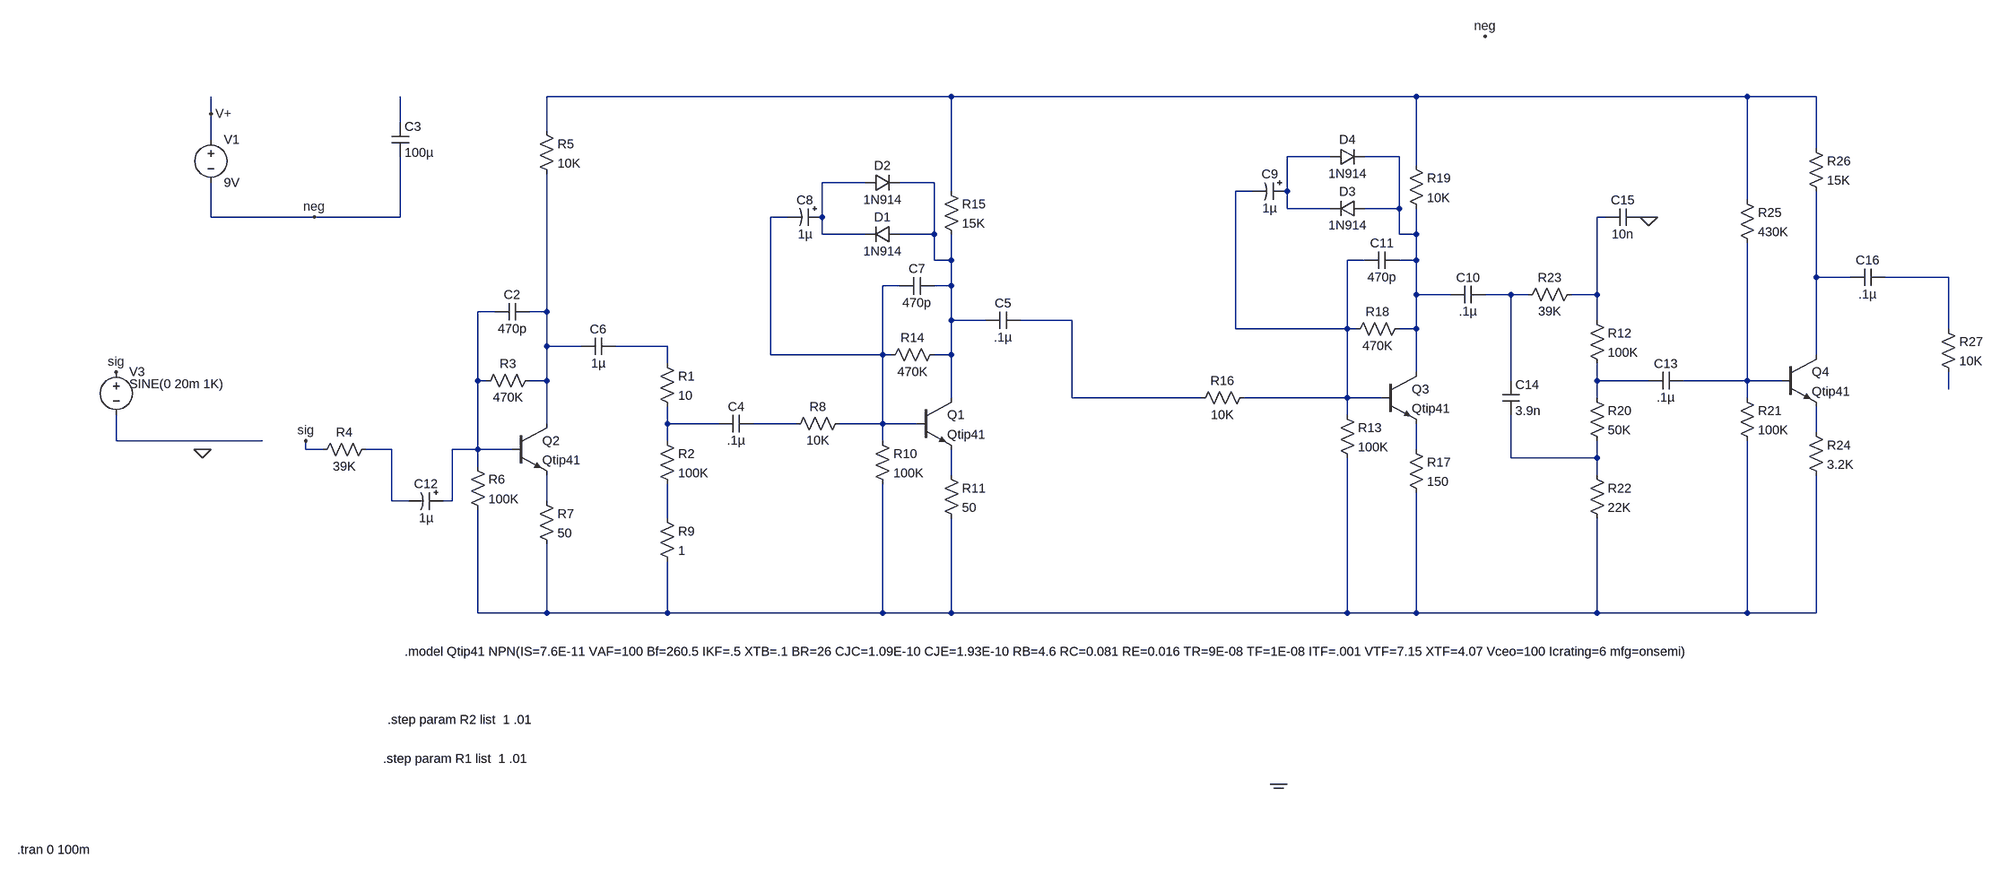
[diagram p0: schematic Bigmuff.asc]
Bigmuff.asc, the LTspice schematic file:
Version 4
SHEET 1 4968 1980
WIRE 2000 160 1248 160
WIRE 2864 160 2000 160
WIRE 3504 160 2864 160
WIRE 3632 160 3504 160
WIRE 624 192 624 160
WIRE 976 208 976 160
WIRE 1248 224 1248 160
WIRE 624 240 624 192
WIRE 3632 256 3632 160
WIRE 2704 272 2624 272
WIRE 2832 272 2768 272
WIRE 2864 288 2864 160
WIRE 1840 320 1760 320
WIRE 1968 320 1904 320
WIRE 2000 336 2000 160
WIRE 2560 336 2528 336
WIRE 2624 336 2624 272
WIRE 3504 352 3504 160
WIRE 2624 368 2624 336
WIRE 2704 368 2624 368
WIRE 2832 368 2832 272
WIRE 2832 368 2768 368
WIRE 624 384 624 320
WIRE 816 384 624 384
WIRE 976 384 976 272
WIRE 976 384 816 384
WIRE 1696 384 1664 384
WIRE 1760 384 1760 320
WIRE 3216 384 3200 384
WIRE 3296 384 3280 384
WIRE 3312 384 3296 384
WIRE 1760 416 1760 384
WIRE 1840 416 1760 416
WIRE 1968 416 1968 320
WIRE 1968 416 1904 416
WIRE 2832 416 2832 368
WIRE 2864 416 2864 368
WIRE 2864 416 2832 416
WIRE 1968 464 1968 416
WIRE 2000 464 2000 416
WIRE 2000 464 1968 464
WIRE 2768 464 2736 464
WIRE 2864 464 2864 416
WIRE 2864 464 2832 464
WIRE 3632 496 3632 336
WIRE 3696 496 3632 496
WIRE 3888 496 3760 496
WIRE 1904 512 1872 512
WIRE 2000 512 2000 464
WIRE 2000 512 1968 512
WIRE 2864 528 2864 464
WIRE 2928 528 2864 528
WIRE 3040 528 2992 528
WIRE 3072 528 3040 528
WIRE 3200 528 3200 384
WIRE 3200 528 3152 528
WIRE 1152 560 1120 560
WIRE 1248 560 1248 304
WIRE 1248 560 1216 560
WIRE 2000 576 2000 512
WIRE 2064 576 2000 576
WIRE 2224 576 2128 576
WIRE 3200 576 3200 528
WIRE 2528 592 2528 336
WIRE 2736 592 2736 464
WIRE 2736 592 2528 592
WIRE 2752 592 2736 592
WIRE 2864 592 2864 528
WIRE 2864 592 2832 592
WIRE 3888 592 3888 496
WIRE 1248 624 1248 560
WIRE 1312 624 1248 624
WIRE 1472 624 1376 624
WIRE 1664 640 1664 384
WIRE 1872 640 1872 512
WIRE 1872 640 1664 640
WIRE 1888 640 1872 640
WIRE 2000 640 2000 576
WIRE 2000 640 1968 640
WIRE 3632 640 3632 496
WIRE 1472 656 1472 624
WIRE 2864 672 2864 592
WIRE 1120 688 1120 560
WIRE 1136 688 1120 688
WIRE 1248 688 1248 624
WIRE 1248 688 1216 688
WIRE 3040 688 3040 528
WIRE 3200 688 3200 656
WIRE 3296 688 3200 688
WIRE 3504 688 3504 432
WIRE 3504 688 3360 688
WIRE 3568 688 3504 688
WIRE 3888 704 3888 672
WIRE 2000 720 2000 640
WIRE 2224 720 2224 576
WIRE 2464 720 2224 720
WIRE 2736 720 2736 592
WIRE 2736 720 2544 720
WIRE 2800 720 2736 720
WIRE 3200 720 3200 688
WIRE 3504 720 3504 688
WIRE 2736 752 2736 720
WIRE 1248 768 1248 688
WIRE 1472 768 1472 736
WIRE 1568 768 1472 768
WIRE 1712 768 1632 768
WIRE 1872 768 1872 640
WIRE 1872 768 1792 768
WIRE 1936 768 1872 768
WIRE 3632 784 3632 736
WIRE 448 800 448 752
WIRE 720 800 448 800
WIRE 1472 800 1472 768
WIRE 1872 800 1872 768
WIRE 800 816 800 800
WIRE 832 816 800 816
WIRE 960 816 912 816
WIRE 1120 816 1120 688
WIRE 1120 816 1072 816
WIRE 1184 816 1120 816
WIRE 2864 816 2864 768
WIRE 3040 832 3040 752
WIRE 3200 832 3200 800
WIRE 3200 832 3040 832
WIRE 1120 848 1120 816
WIRE 2000 864 2000 816
WIRE 3200 864 3200 832
WIRE 960 912 960 816
WIRE 992 912 960 912
WIRE 1072 912 1072 816
WIRE 1072 912 1056 912
WIRE 1248 912 1248 864
WIRE 1472 944 1472 880
WIRE 1120 1120 1120 928
WIRE 1248 1120 1248 992
WIRE 1248 1120 1120 1120
WIRE 1472 1120 1472 1024
WIRE 1472 1120 1248 1120
WIRE 1872 1120 1872 880
WIRE 1872 1120 1472 1120
WIRE 2000 1120 2000 944
WIRE 2000 1120 1872 1120
WIRE 2736 1120 2736 832
WIRE 2736 1120 2000 1120
WIRE 2864 1120 2864 896
WIRE 2864 1120 2736 1120
WIRE 3200 1120 3200 944
WIRE 3200 1120 2864 1120
WIRE 3504 1120 3504 800
WIRE 3504 1120 3200 1120
WIRE 3632 1120 3632 864
WIRE 3632 1120 3504 1120
FLAG 624 192 V+
FLAG 448 672 sig
FLAG 800 800 sig
FLAG 3296 384 0
FLAG 2608 1472 COM
FLAG 816 384 neg
FLAG 2992 -144 neg
FLAG 608 816 0
SYMBOL cap 1376 608 R90
WINDOW 0 0 32 VBottom 2
WINDOW 3 32 32 VTop 2
SYMATTR InstName C6
SYMATTR Value 1µ
SYMBOL npn 1184 768 R0
SYMATTR InstName Q2
SYMATTR Value Qtip41
SYMBOL res 1104 832 R0
SYMATTR InstName R6
SYMATTR Value 100K
SYMBOL res 1232 896 R0
SYMATTR InstName R7
SYMATTR Value 50
SYMBOL voltage 624 224 R0
SYMATTR InstName V1
SYMATTR Value 9V
SYMBOL voltage 448 656 R0
WINDOW 3 24 38 Left 2
SYMATTR Value SINE(0 20m 1K)
SYMATTR InstName V3
SYMATTR Value2 AC 1
SYMBOL res 1456 640 R0
SYMATTR InstName R1
SYMATTR Value 10
SYMBOL res 1456 784 R0
SYMATTR InstName R2
SYMATTR Value 100K
SYMBOL res 1232 672 R90
WINDOW 0 0 56 VBottom 2
WINDOW 3 32 56 VTop 2
SYMATTR InstName R3
SYMATTR Value 470K
SYMBOL res 928 800 R90
WINDOW 0 0 56 VBottom 2
WINDOW 3 32 56 VTop 2
SYMATTR InstName R4
SYMATTR Value 39K
SYMBOL cap 1216 544 R90
WINDOW 0 0 32 VBottom 2
WINDOW 3 32 32 VTop 2
SYMATTR InstName C2
SYMATTR Value 470p
SYMBOL res 1232 208 R0
SYMATTR InstName R5
SYMATTR Value 10K
SYMBOL cap 960 208 R0
SYMATTR InstName C3
SYMATTR Value 100µ
SYMBOL res 1696 784 R270
WINDOW 0 32 56 VTop 2
WINDOW 3 0 56 VBottom 2
SYMATTR InstName R8
SYMATTR Value 10K
SYMBOL cap 1568 784 R270
WINDOW 0 32 32 VTop 2
WINDOW 3 0 32 VBottom 2
SYMATTR InstName C4
SYMATTR Value .1µ
SYMBOL res 1456 928 R0
SYMATTR InstName R9
SYMATTR Value 1
SYMBOL cap 2128 560 R90
WINDOW 0 0 32 VBottom 2
WINDOW 3 32 32 VTop 2
SYMATTR InstName C5
SYMATTR Value .1µ
SYMBOL npn 1936 720 R0
SYMATTR InstName Q1
SYMATTR Value Qtip41
SYMBOL res 1856 784 R0
SYMATTR InstName R10
SYMATTR Value 100K
SYMBOL res 1984 848 R0
SYMATTR InstName R11
SYMATTR Value 50
SYMBOL res 1984 624 R90
WINDOW 0 0 56 VBottom 2
WINDOW 3 32 56 VTop 2
SYMATTR InstName R14
SYMATTR Value 470K
SYMBOL cap 1968 496 R90
WINDOW 0 0 32 VBottom 2
WINDOW 3 32 32 VTop 2
SYMATTR InstName C7
SYMATTR Value 470p
SYMBOL res 1984 320 R0
SYMATTR InstName R15
SYMATTR Value 15K
SYMBOL res 2448 736 R270
WINDOW 0 32 56 VTop 2
WINDOW 3 0 56 VBottom 2
SYMATTR InstName R16
SYMATTR Value 10K
SYMBOL diode 1904 400 R90
WINDOW 0 0 32 VBottom 2
WINDOW 3 32 32 VTop 2
SYMATTR InstName D1
SYMATTR Value 1N914
SYMBOL diode 1840 336 R270
WINDOW 0 32 32 VTop 2
WINDOW 3 0 32 VBottom 2
SYMATTR InstName D2
SYMATTR Value 1N914
SYMBOL cap 2992 512 R90
WINDOW 0 0 32 VBottom 2
WINDOW 3 32 32 VTop 2
SYMATTR InstName C10
SYMATTR Value .1µ
SYMBOL npn 2800 672 R0
SYMATTR InstName Q3
SYMATTR Value Qtip41
SYMBOL res 2720 736 R0
SYMATTR InstName R13
SYMATTR Value 100K
SYMBOL res 2848 800 R0
SYMATTR InstName R17
SYMATTR Value 150
SYMBOL res 2848 576 R90
WINDOW 0 0 56 VBottom 2
WINDOW 3 32 56 VTop 2
SYMATTR InstName R18
SYMATTR Value 470K
SYMBOL cap 2832 448 R90
WINDOW 0 0 32 VBottom 2
WINDOW 3 32 32 VTop 2
SYMATTR InstName C11
SYMATTR Value 470p
SYMBOL res 2848 272 R0
SYMATTR InstName R19
SYMATTR Value 10K
SYMBOL diode 2768 352 R90
WINDOW 0 0 32 VBottom 2
WINDOW 3 32 32 VTop 2
SYMATTR InstName D3
SYMATTR Value 1N914
SYMBOL diode 2704 288 R270
WINDOW 0 32 32 VTop 2
WINDOW 3 0 32 VBottom 2
SYMATTR InstName D4
SYMATTR Value 1N914
SYMBOL res 3184 560 R0
SYMATTR InstName R12
SYMATTR Value 100K
SYMBOL res 3184 704 R0
SYMATTR InstName R20
SYMATTR Value 50K
SYMBOL cap 3296 704 R270
WINDOW 0 32 32 VTop 2
WINDOW 3 0 32 VBottom 2
SYMATTR InstName C13
SYMATTR Value .1µ
SYMBOL res 3184 848 R0
SYMATTR InstName R22
SYMATTR Value 22K
SYMBOL res 3168 512 R90
WINDOW 0 0 56 VBottom 2
WINDOW 3 32 56 VTop 2
SYMATTR InstName R23
SYMATTR Value 39K
SYMBOL cap 3024 688 R0
SYMATTR InstName C14
SYMATTR Value 3.9n
SYMBOL cap 3280 368 R90
WINDOW 0 0 32 VBottom 2
WINDOW 3 32 32 VTop 2
SYMATTR InstName C15
SYMATTR Value 10n
SYMBOL cap 3760 480 R90
WINDOW 0 0 32 VBottom 2
WINDOW 3 32 32 VTop 2
SYMATTR InstName C16
SYMATTR Value .1µ
SYMBOL npn 3568 640 R0
SYMATTR InstName Q4
SYMATTR Value Qtip41
SYMBOL res 3488 704 R0
SYMATTR InstName R21
SYMATTR Value 100K
SYMBOL res 3616 768 R0
SYMATTR InstName R24
SYMATTR Value 3.2K
SYMBOL res 3616 240 R0
SYMATTR InstName R26
SYMATTR Value 15K
SYMBOL res 3488 336 R0
SYMATTR InstName R25
SYMATTR Value 430K
SYMBOL res 3872 576 R0
SYMATTR InstName R27
SYMATTR Value 10K
SYMBOL polcap 1760 368 R90
WINDOW 0 0 32 VBottom 2
WINDOW 3 32 32 VTop 2
SYMATTR InstName C8
SYMATTR Value 1µ
SYMBOL polcap 2624 320 R90
WINDOW 0 0 32 VBottom 2
WINDOW 3 32 32 VTop 2
SYMATTR InstName C9
SYMATTR Value 1µ
SYMBOL polcap 1056 896 R90
WINDOW 0 0 32 VBottom 2
WINDOW 3 32 32 VTop 2
SYMATTR InstName C12
SYMATTR Value 1µ
TEXT 264 1640 Left 2 !.tran 0 100m
TEXT 944 1424 Left 2 !.step param R1 list  1 .01
TEXT 984 1192 Left 2 !.model Qtip41 NPN(IS=7.6E-11 VAF=100 Bf=260.5 IKF=.5 XTB=.1 BR=26 CJC=1.09E-10 CJE=1.93E-10 RB=4.6 RC=0.081 RE=0.016 TR=9E-08 TF=1E-08 ITF=.001 VTF=7.15 XTF=4.07 Vceo=100 Icrating=6 mfg=onsemi)
TEXT 952 1352 Left 2 !.step param R2 list  1 .01

The netlist it stands for:
* Bigmuff.asc
C6 N016 N014 1µ
Q2 N014 N013 N028 0 Qtip41
R6 N013 N030 100K
R7 N028 N030 50
V1 V+ neg 9V
V3 sig N023 SINE(0 20m 1K) AC 1
R1 N016 N020 10
R2 N020 N029 100K
R3 N014 N013 470K
R4 N024 sig 39K
C2 N014 N013 470p
R5 N001 N014 10K
C3 N002 neg 100µ
R8 N021 N008 10K
C4 N020 N021 .1µ
R9 N029 N030 1
C5 N015 N006 .1µ
Q1 N006 N008 N027 0 Qtip41
R10 N008 N030 100K
R11 N027 N030 50
R14 N006 N008 470K
C7 N006 N008 470p
R15 N001 N006 15K
R16 N015 N007 10K
D1 N006 N005 1N914
D2 N005 N006 1N914
C10 N012 N004 .1µ
Q3 N004 N007 N025 0 Qtip41
R13 N007 N030 100K
R17 N025 N030 150
R18 N004 N007 470K
C11 N004 N007 470p
R19 N001 N004 10K
D3 N004 N003 1N914
D4 N003 N004 1N914
R12 N009 N017 100K
R20 N017 N026 50K
C13 N017 N018 .1µ
R22 N026 N030 22K
R23 N009 N012 39K
C14 N012 N026 3.9n
C15 0 N009 10n
C16 N011 N010 .1µ
Q4 N010 N018 N022 0 Qtip41
R21 N018 N030 100K
R24 N022 N030 3.2K
R26 N001 N010 15K
R25 N001 N018 430K
R27 N011 N019 10K
C8 N005 N008 1µ
C9 N003 N007 1µ
C12 N013 N024 1µ
.model D D
.lib standard.dio
.model NPN NPN
.model PNP PNP
.lib standard.bjt
.tran 0 100m
.step param R1 list  1 .01
.model Qtip41 NPN(IS=7.6E-11 VAF=100 Bf=260.5 IKF=.5 XTB=.1 BR=26 CJC=1.09E-10 CJE=1.93E-10 RB=4.6 RC=0.081 RE=0.016 TR=9E-08 TF=1E-08 ITF=.001 VTF=7.15 XTF=4.07 Vceo=100 Icrating=6 mfg=onsemi)
.step param R2 list  1 .01
.backanno
.end